# Altium schematic sheet B2B_connectors .SchDoc: =ProjectName
size 420 x 297 mm; Author: SBH; CompanyName: WUT; DrawnBy: SBH; Organization: ISE-WUT; Address1: Warsaw Univeristy of Technology; Address2: Nowowiejska 15/19; Revision: -; SheetNumber: -; SheetTotal: -; EDA_Number: ARTIQ; Projet: ADC/DAC MEZZANINE; ModifiedBy: -; CreateDate: XX/XX/XXXX; CheckedDate: -; Title2: B2B_connectors .SchDoc; DivGrp: ISE; Designer: SBH; ModifiedDate: -; ProjectName: ADC/DAC MEZZANINE
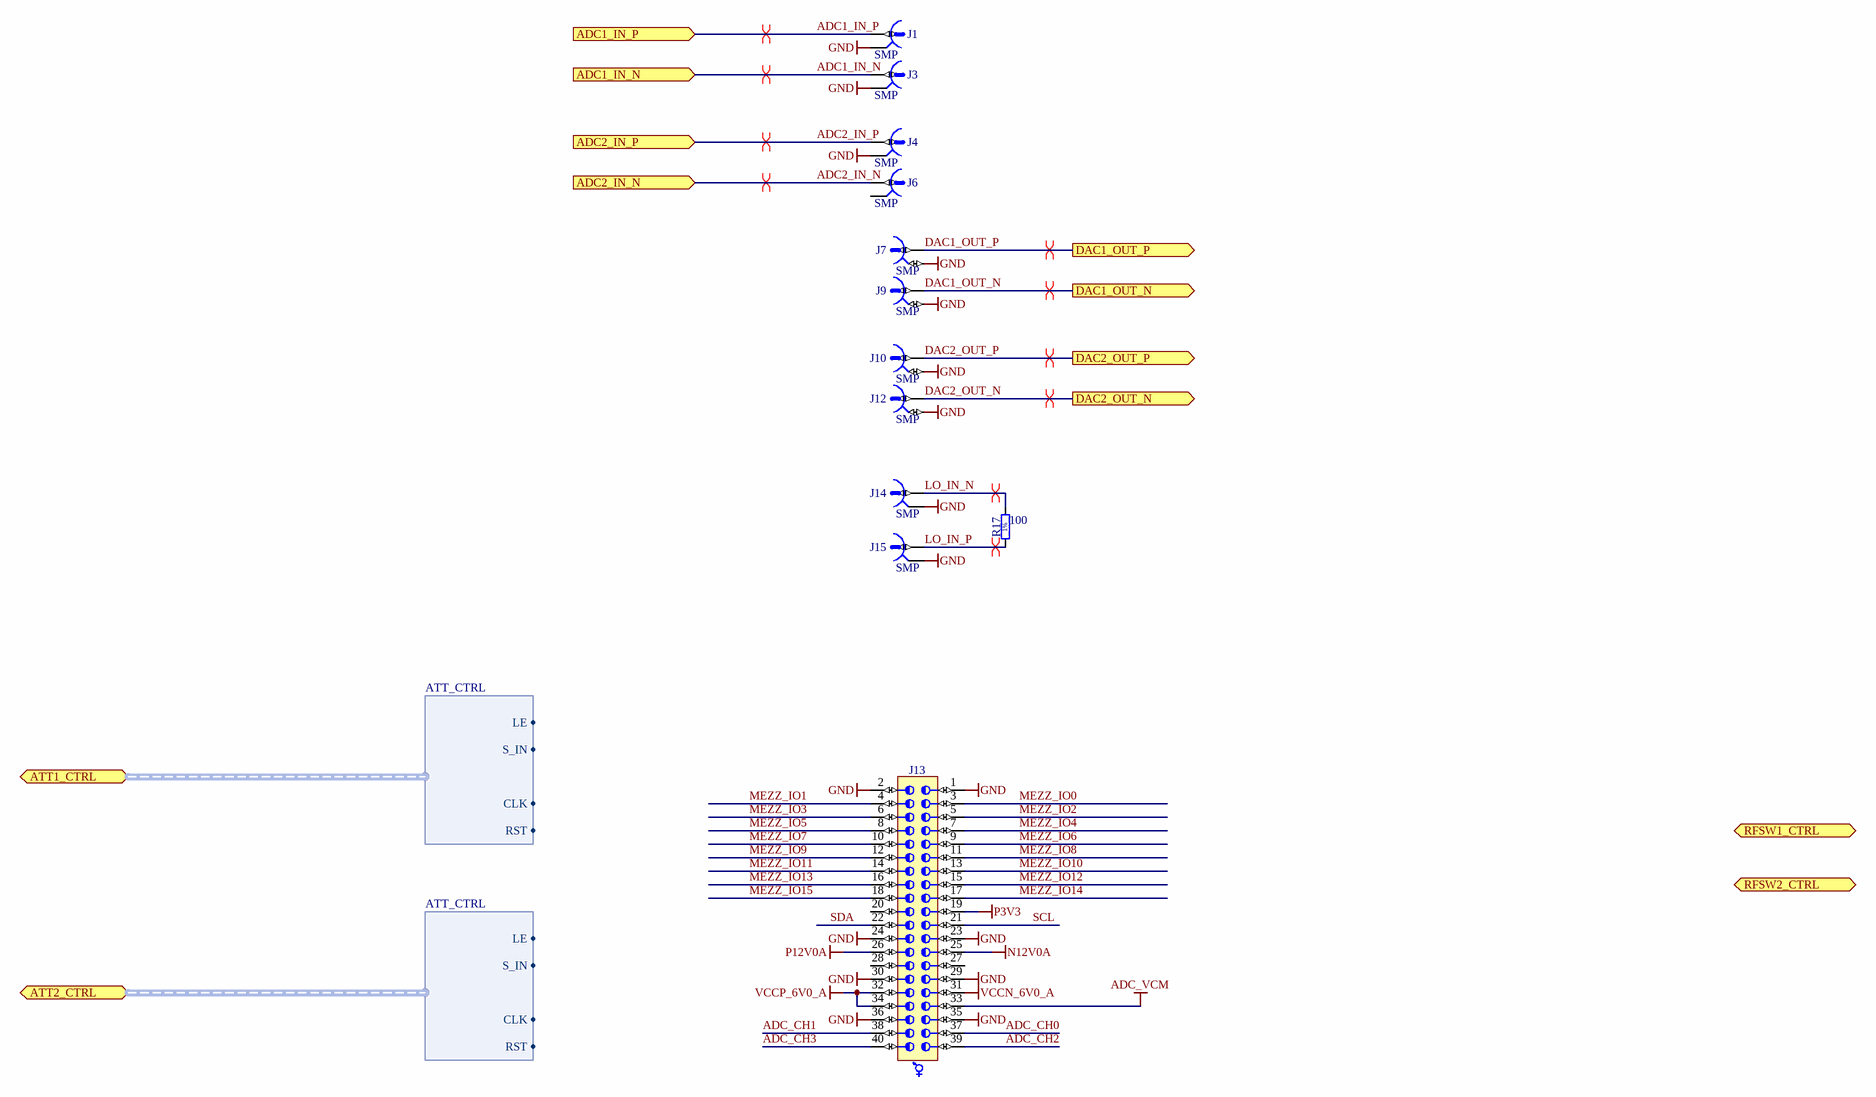
[diagram p0: B2B_connectors .SchDoc]

## Parts
J1  SMP  [AMPHENOL_SMP-MSLD-PCT-10]
J3  SMP  [AMPHENOL_SMP-MSLD-PCT-10]
J4  SMP  [AMPHENOL_SMP-MSLD-PCT-10]
J6  SMP  [AMPHENOL_SMP-MSLD-PCT-10]
J7  SMP  [MOLEX_85305-0232]
J9  SMP  [MOLEX_85305-0232]
J10  SMP  [MOLEX_85305-0232]
J12  SMP  [MOLEX_85305-0232]
J13  (no value)  [SAMTEC_LSS-120-03-L-DV-A]
J14  SMP  [AMPHENOL_SMP-MSLD-PCT-10]
J15  SMP  [AMPHENOL_SMP-MSLD-PCT-10]
R17  100  [RESC1005X40N]

## Ports
ADC1_IN_N (in), ADC1_IN_P (in), ADC2_IN_N (in), ADC2_IN_P (in), ATT1_CTRL (harness ATT_CTRL), ATT2_CTRL (harness ATT_CTRL), DAC1_OUT_N (out), DAC1_OUT_P (out), DAC2_OUT_N (out), DAC2_OUT_P (out), RFSW1_CTRL (out), RFSW2_CTRL (out)

## Harnesses
ATT_CTRL: LE, S_IN, CLK, RST

## Nets
ADC_VCM: J13.33
GND: J1.2 J3.2 J4.2 J7.2 J9.2 J10.2 J12.2 J13.1 J13.2 J13.23 J13.24 J13.29 J13.30 J13.35 J13.36 J14.2 J15.2
N12V0A: J13.25
P3V3: J13.19
P12V0A: J13.26
VCCN_6V0_A: J13.31
VCCP_6V0_A: J13.32 J13.34
ADC1_IN_N: J3.1 ; port ADC1_IN_N
ADC1_IN_P: J1.1 ; port ADC1_IN_P
ADC2_IN_N: J6.1 ; port ADC2_IN_N
ADC2_IN_P: J4.1 ; port ADC2_IN_P
ADC_CH0: J13.37
ADC_CH1: J13.38
ADC_CH2: J13.39
ADC_CH3: J13.40
DAC1_OUT_N: J9.1 ; port DAC1_OUT_N
DAC1_OUT_P: J7.1 ; port DAC1_OUT_P
DAC2_OUT_N: J12.1 ; port DAC2_OUT_N
DAC2_OUT_P: J10.1 ; port DAC2_OUT_P
LO_IN_N: J14.1 R17.2
LO_IN_P: J15.1 R17.1
MEZZ_IO0: J13.3
MEZZ_IO1: J13.4
MEZZ_IO2: J13.5
MEZZ_IO3: J13.6
MEZZ_IO4: J13.7
MEZZ_IO5: J13.8
MEZZ_IO6: J13.9
MEZZ_IO7: J13.10
MEZZ_IO8: J13.11
MEZZ_IO9: J13.12
MEZZ_IO10: J13.13
MEZZ_IO11: J13.14
MEZZ_IO12: J13.15
MEZZ_IO13: J13.16
MEZZ_IO14: J13.17
MEZZ_IO15: J13.18
SCL: J13.21
SDA: J13.22

Not connected (* = marked no-connect by the designer): J6 2; J13 20 27 28

## Layout directives
differential pair: ADC1_IN_N, ADC1_IN_P, ADC2_IN_N, ADC2_IN_P, DAC1_OUT_N, DAC1_OUT_P, DAC2_OUT_N, DAC2_OUT_P, LO_IN_N, LO_IN_P

## Notes on the sheet
- Project/Equipment
- Designer
- Drawn by
- Check.by
- File
- Last Mod.
- Print Date
- Sheet
- Size
- A3
- of
- Rev
- (in symbol R0402_100R_1%_0.0625W_100PPM) 1%

## Library data of the parts
J1 J3 J4 J6 J14 J15 = CON_SMP-MSLD-PCT-10: 50 Ohms, SMP Surface/THT Mount Plug, Limited Detent; Part Description: 50 Ohms, SMP Surface Mount Plug, Limited Detent; Manufacturer: AMPHENOL; PressFit: No; Part Number: AMPHENOL_SMP-MSLD-PCT-10; Component Kind: Standard; Component Type: Standard; Pin Count: 2; Family: SMP; Mounted: Yes; Socket: No; SMD: No; Sense: No; Status: None; Manufacturer Part Number: SMP-MSLD-PCT-10; ComponentHeight: 4.1mm; HelpURL: \\cern.ch\dfs\Applications\Altium\Datasheets\MOLEX_85305-0232.pdf; Author: GK; CreateDate: 11.11.2016; LatestRevisionDate: 11.11.2016
J7 J9 J10 J12 = MOLEX_85305-0232: Part Description: 50 Ohms, SMP Surface Mount Plug, Limited Detent; Manufacturer: MOLEX; PressFit: No; Part Number: MOLEX_85305-0232; Component Kind: Standard; Component Type: Standard; Pin Count: 2; Family: SMP; Mounted: Yes; Socket: No; SMD: Yes; Sense: No; Status: None; Manufacturer Part Number: 85305-0232; ComponentHeight: 4.1mm; HelpURL: \\cern.ch\dfs\Applications\Altium\Datasheets\MOLEX_85305-0232.pdf; Author: CERN DEM JMW; CreateDate: 09.08.2016; LatestRevisionDate: 09.08.2016
J13 = SAMTEC_LSS-120-03-L-DV-A: Connector 40 Hermaphroditic; Part Description: 40 Contacts, Pitch 0.635mm, Razor Beam LSS Vertical High Speed Hermaphroditic Strip (Lead Style 5.49mm); Manufacturer: SAMTEC; PressFit: No; Part Number: SAMTEC_LSS-120-03-L-DV-A; Component Kind: Standard; Component Type: Standard; Pin Count: 40; Mounted: Yes; Socket: No; Sense: No; SMD: Yes; Status: None; Manufacturer Part Number: LSS-120-03-L-DV-A; ComponentHeight: 5.57mm; HelpURL: \\cern.ch\dfs\Applications\Altium\Datasheets\SAMTEC_LSS-120-03-L-DV-A.pdf; Author: CERN DEM JMW; CreateDate: 10.11.2015; LatestRevisionDate: 10.11.2015
R17 = R0402_100R_1%_0.0625W_100PPM: Resistor - 1%; Part Description: General Purpose Thick Film Chip Resistor; Manufacturer: GENERIC; Manufacturer1 Part Number: 232270671001L; TC: ±100ppm/°C; Part Number: R0402_100R_1%_0.0625W_100PPM; Component Kind: Standard; Component Type: Standard; Pin Count: 2; Value: 100; Status: Not recommended; Power: 0.0625W; Tolerance: ±1%; Manufacturer Part Number: R0402_100R_1%_0.0625W_100PPM; Case: 0402; Mounted: Yes; Sense: No; Socket: No; SMD: Yes; Manufacturer1 Example: YAGEO PHYCOMP; Manufacturer1 ComponentHeight: 0.4mm; HelpURL: \\cern.ch\dfs\Applications\Altium\Datasheets\R0402_Phycomp_RC0402.pdf; Author: CERN DEM JLC; CreateDate: 03.12.2007; LatestRevisionDate: 17.10.2012